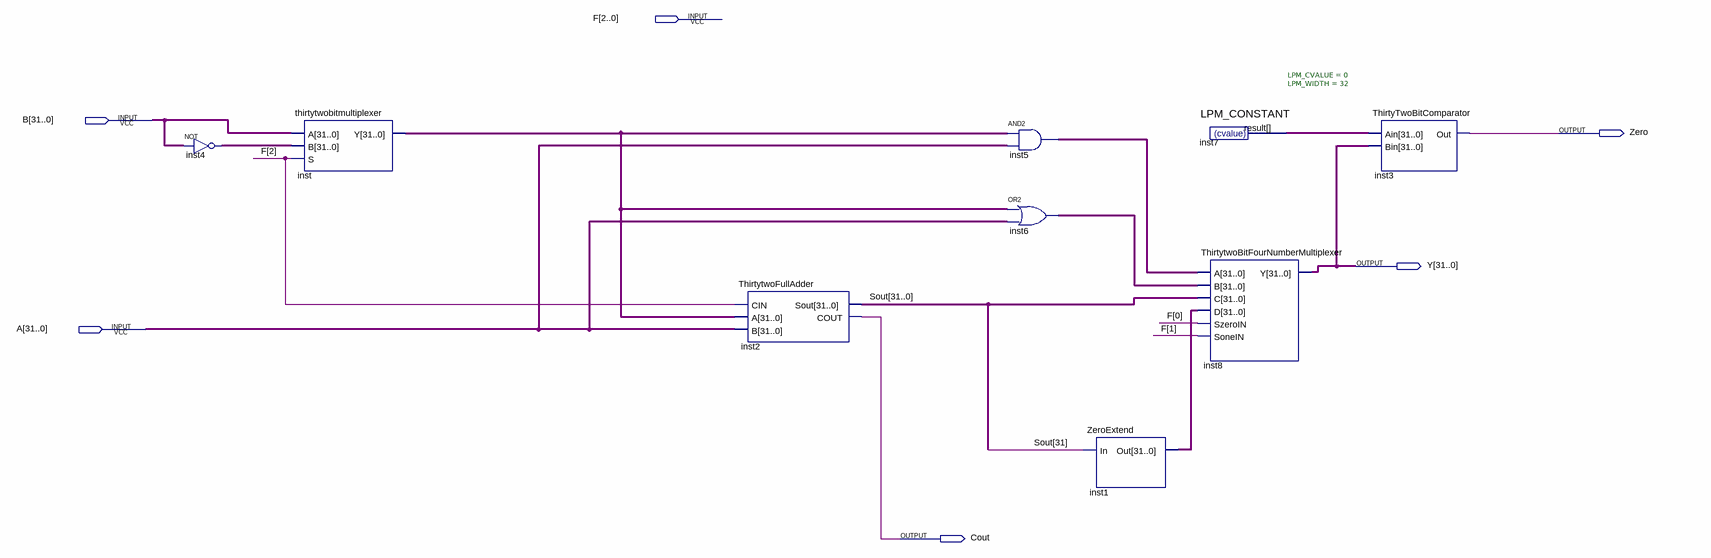
[diagram p0: schematic sheet]
// Quartus schematic ALU.bdf as structural Verilog: 9 symbols, 6 pins
module ALU (
  input  [2:0] F,
  input  [31:0] B,
  input  [31:0] A,
  output Zero,
  output [31:0] Y,
  output Cout
);

  wire [31:0] inst1_out, inst4_out, inst5_out, inst6_out, inst7_result, inst_y, Sout;

  assign inst4_out = ~B;  // NOT inst4, 32 bits wide
  thirtytwobitmultiplexer inst (.A(B), .B(inst4_out), .S(F[2]), .Y(inst_y));
  ThirtytwoFullAdder inst2 (.CIN(F[2]), .A(inst_y), .B(A), .Sout(Sout), .COUT(Cout));
  assign inst5_out = inst_y & A;  // AND2 inst5, 32 bits wide
  assign inst6_out = inst_y | A;  // OR2 inst6, 32 bits wide
  ZeroExtend inst1 (.In(Sout[31]), .Out(inst1_out));
  LPM_CONSTANT #(.LPM_CVALUE(0), .LPM_WIDTH(32)) inst7 (.result(inst7_result));
  ThirtytwoBitFourNumberMultiplexer inst8 (
    .A(inst5_out), .B(inst6_out), .C(Sout), .D(inst1_out), .SzeroIN(F[0]), .SoneIN(F[1]), .Y(Y));
  ThirtyTwoBitComparator inst3 (.Ain(inst7_result), .Bin(Y), .Out(Zero));
endmodule
